# Altium schematic sheet Sheet1.SchDoc
size A3
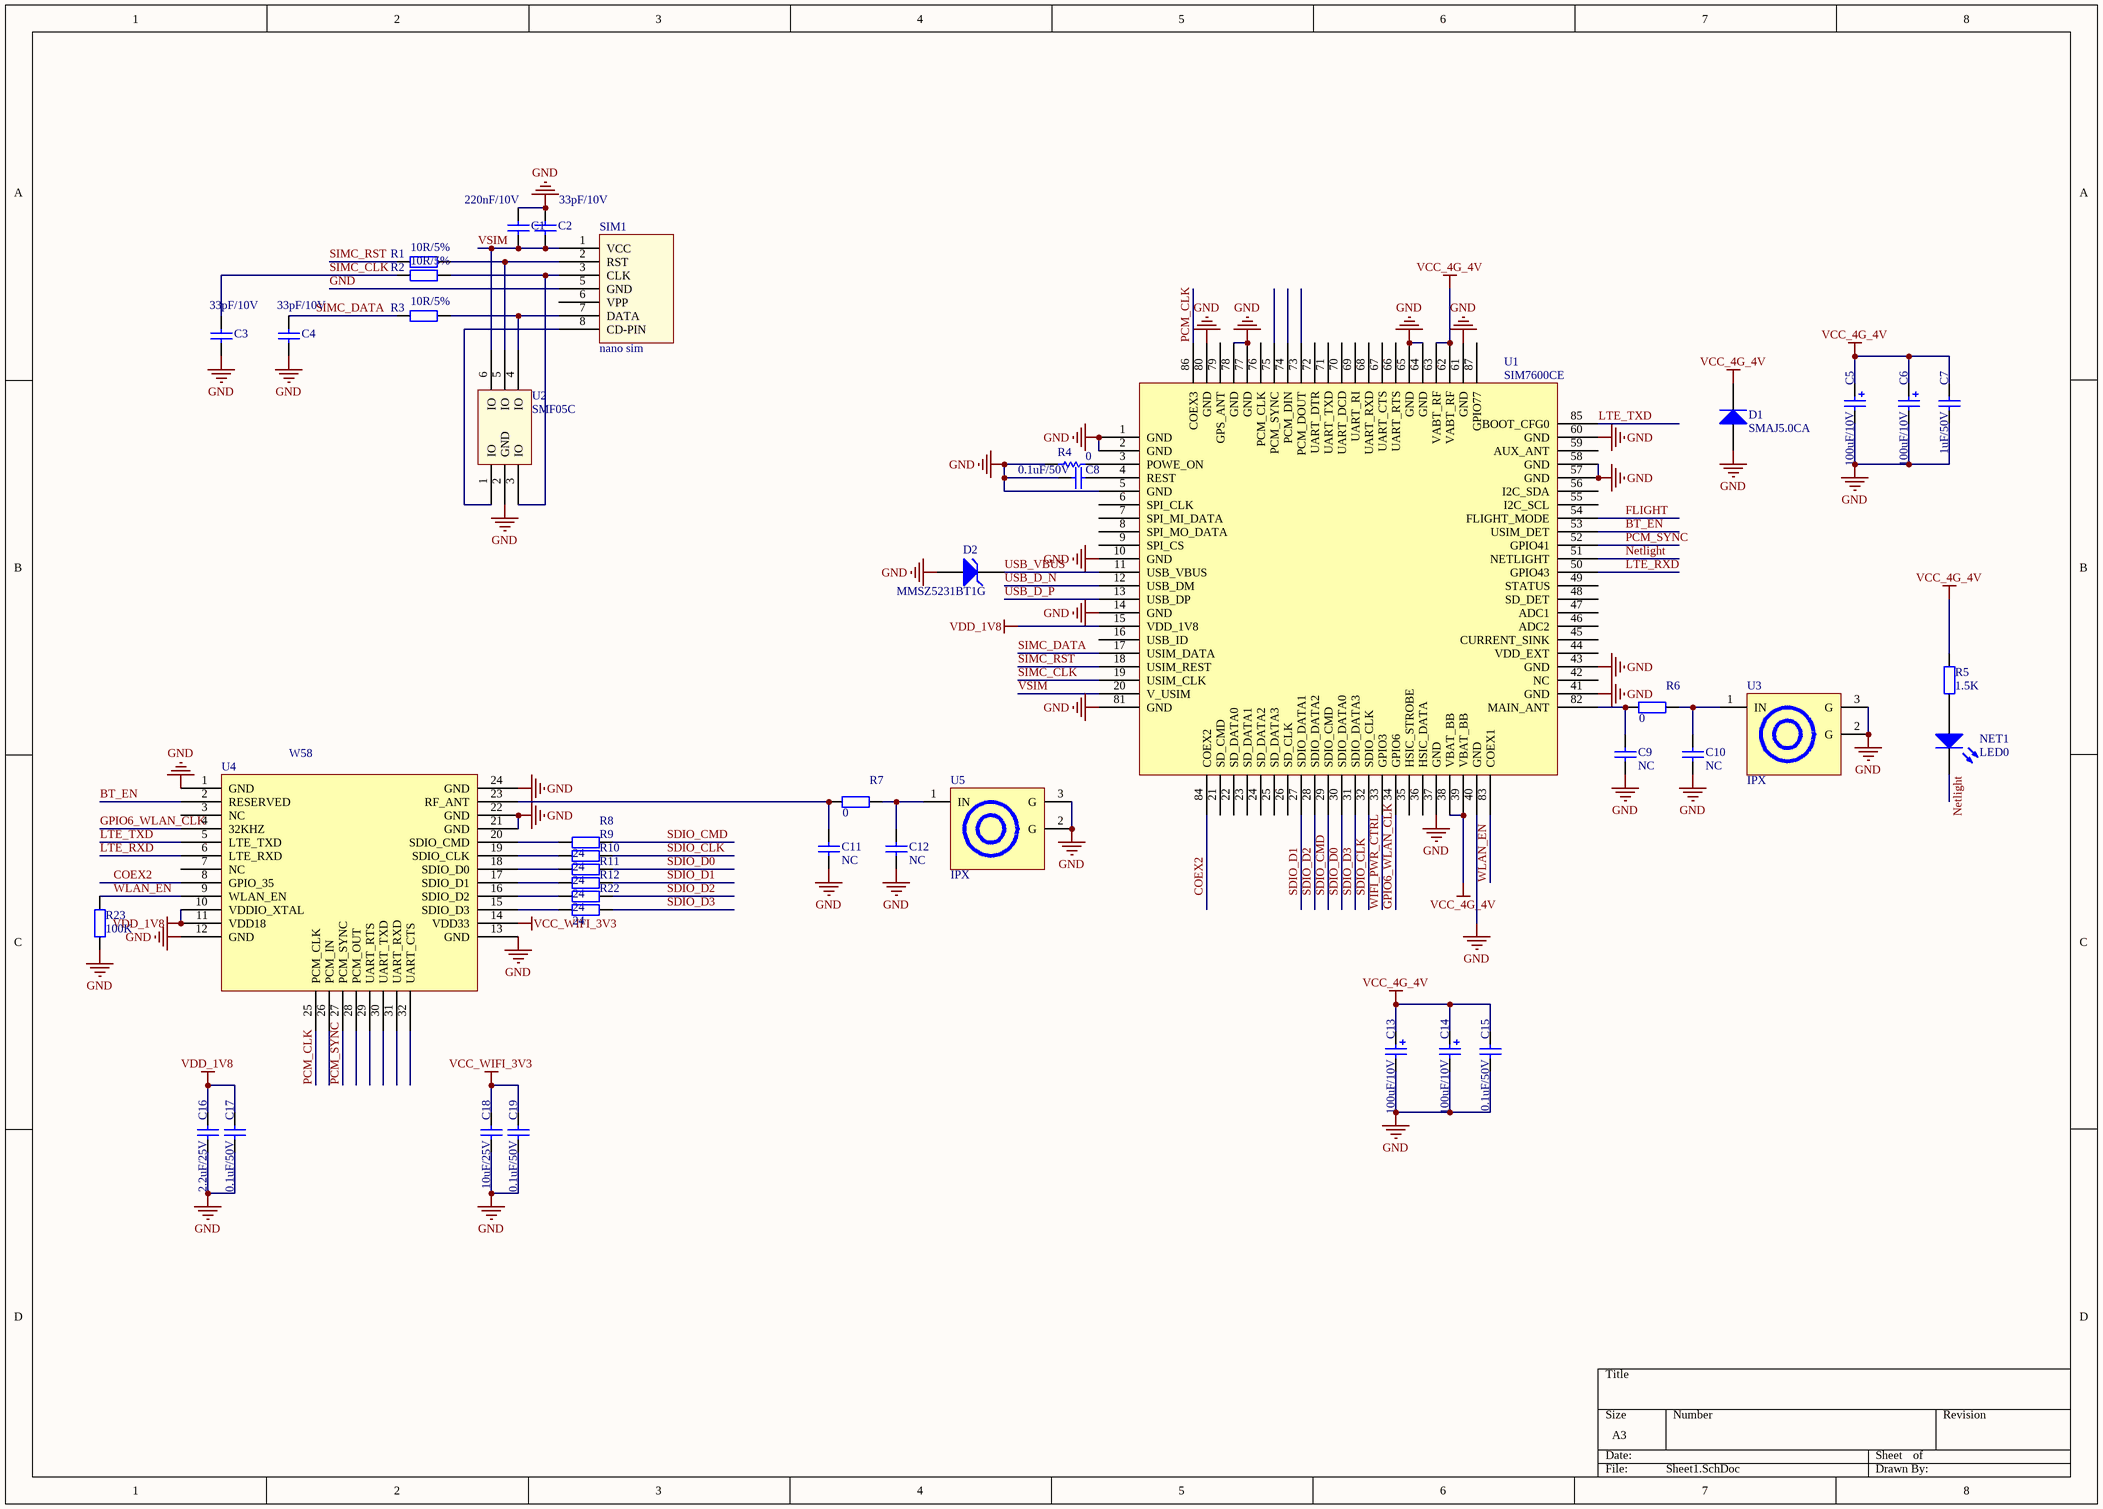
[diagram p0: Sheet1.SchDoc]

## Parts
C1  220nF/10V  [C0402]
C2  33pF/10V  [C0402]
C3  33pF/10V  [C0402]
C4  33pF/10V  [C0402]
C5  100uF/10V  [3528]
C6  100uF/10V  [3528]
C7  1uF/50V  [0402C]
C8  0.1uF/50V  [0402C]
C9  NC  [0402C]
C10  NC  [0402C]
C11  NC  [0402C]
C12  NC  [0402C]
C13  100uF/10V  [3528]
C14  100uF/10V  [3528]
C15  0.1uF/50V  [0402C]
C16  2.2uF/25V  [0402C]
C17  0.1uF/50V  [0402C]
C18  10uF/25V  [0402C]
C19  0.1uF/50V  [0402C]
D1  SMAJ5.0CA  [SMA]
D2  MMSZ5231BT1G  [SOD123]
NET1  LED0  [0603LED]
R1  10R/5%  [0402R]
R2  10R/5%  [0402R]
R3  10R/5%  [0402R]
R4  0  [0603R]
R5  1.5K  [0402R]
R6  0  [0402R]
R7  0  [0402R]
R8  24  [0402R]
R9  24  [0402R]
R10  24  [0402R]
R11  24  [0402R]
R12  24  [0402R]
R22  24  [0402R]
R23  100K  [0402R]
SIM1  nano sim  [Nano SIM]
U1  SIM7600CE  [SIM7600CE]
U2  SMF05C  [SC70-6L]
U3  IPX  [ECT8180001581]
U4  W58  [W58]
U5  IPX  [ECT8180001581]

## Nets
GND: C1.1 C2.1 C3.2 C4.2 C5.2 C6.2 C7.2 C8.1 C9.1 C10.1 C11.1 C12.1 C13.2 C14.2 C15.2 C16.2 C17.2 C18.2 C19.2 D1.1(A) D2.A R4.1 R23.1 SIM1.5(GND) U1.1(GND) U1.2(GND) U1.5(GND) U1.10(GND) U1.14(GND) U1.37(GND) U1.40(GND) U1.41(GND) U1.43(GND) U1.57(GND) U1.58(GND) U1.60(GND) U1.61(GND) U1.64(GND) U1.65(GND) U1.77(GND) U1.78(GND) U1.80(GND) U1.81(GND) U2.2(GND) U3.2(G) U3.3(G) U4.1(GND) U4.12(GND) U4.13(GND) U4.21(GND) U4.22(GND) U4.24(GND) U5.2(G) U5.3(G)
VCC_4G_4V: C5.1 C6.1 C7.1 C13.1 C14.1 C15.1 D1.2(K) R5.1 U1.38(VBAT_BB) U1.39(VBAT_BB) U1.62(VABT_RF) U1.63(VABT_RF)
VCC_WIFI_3V3: C18.1 C19.1 U4.14(VDD33)
VDD_1V8: C16.1 C17.1 U1.15(VDD_1V8) U4.10(VDDIO_XTAL) U4.11(VDD18)
BT_EN: U1.53(USIM_DET) U4.2(RESERVED)
COEX2: U1.84(COEX2) U4.8(GPIO_35)
FLIGHT: U1.54(FLIGHT_MODE)
GPIO6_WLAN_CLK: U1.34(GPIO6) U4.4(32KHZ)
LTE_RXD: U1.50(GPIO43) U4.6(LTE_RXD)
LTE_TXD: U1.85(BOOT_CFG0) U4.5(LTE_TXD)
Netlight: NET1.2(K) U1.51(NETLIGHT)
PCM_CLK: U1.86(COEX3) U4.25(PCM_CLK)
PCM_SYNC: U1.52(GPIO41) U4.27(PCM_SYNC)
SDIO_CLK: R9.2 U1.32(SDIO_CLK)
SDIO_CMD: R8.2 U1.29(SDIO_CMD)
SDIO_D0: R10.2 U1.30(SDIO_DATA0)
SDIO_D1: R11.2 U1.27(SDIO_DATA1)
SDIO_D2: R12.2 U1.28(SDIO_DATA2)
SDIO_D3: R22.2 U1.31(SDIO_DATA3)
SIMC_CLK: C3.1 R2.2 U1.19(USIM_CLK)
SIMC_DATA: C4.1 R3.2 U1.17(USIM_DATA)
SIMC_RST: R1.2 U1.18(USIM_REST)
USB_D_N: U1.12(USB_DM)
USB_D_P: U1.13(USB_DP)
USB_VBUS: D2.K U1.11(USB_VBUS)
VSIM: C1.2 C2.2 SIM1.1(VCC) U1.20(V_USIM) U2.6(IO)
WIFI_PWR_CTRL: U1.33(GPIO3)
WLAN_EN: R23.2 U1.83(COEX1) U4.9(WLAN_EN)
NetC8_2: C8.2 U1.4(REST)
NetC9_2: C9.2 R6.1 U1.82(MAIN_ANT)
NetC10_2: C10.2 R6.2 U3.1(IN)
NetC11_2: C11.2 R7.1 U4.23(RF_ANT)
NetC12_2: C12.2 R7.2 U5.1(IN)
NetNET1_1: NET1.1(A) R5.2
NetR1_1: R1.1 SIM1.2(RST) U2.5(IO)
NetR2_1: R2.1 SIM1.3(CLK) U2.3(IO)
NetR3_1: R3.1 SIM1.7(DATA) U2.4(IO)
NetR4_2: R4.2 U1.3(POWE_ON)
NetR8_1: R8.1 U4.20(SDIO_CMD)
NetR9_1: R9.1 U4.19(SDIO_CLK)
NetR10_1: R10.1 U4.18(SDIO_D0)
NetR11_1: R11.1 U4.17(SDIO_D1)
NetR12_1: R12.1 U4.16(SDIO_D2)
NetR22_1: R22.1 U4.15(SDIO_D3)
NetSIM1_8: SIM1.8(CD-PIN) U2.1(IO)

Not connected (* = marked no-connect by the designer): SIM1 6(VPP); U1 6(SPI_CLK) 7(SPI_MI_DATA) 8(SPI_MO_DATA) 9(SPI_CS) 16(USB_ID) 21(SD_CMD) 22(SD_DATA0) 23(SD_DATA1) 24(SD_DATA2) 25(SD_DATA3) 26(SD_CLK) 35(HSIC_STROBE) 36(HSIC_DATA) 42(NC) 44(VDD_EXT) 45(CURRENT_SINK) 46(ADC2) 47(ADC1) 48(SD_DET) 49(STATUS) 55(I2C_SCL) 56(I2C_SDA) 59(AUX_ANT) 66(UART_RTS) 67(UART_CTS) 68(UART_RXD) 69(UART_RI) 70(UART_DCD) 71(UART_TXD) 72(UART_DTR) 73(PCM_DOUT) 74(PCM_DIN) 75(PCM_SYNC) 76(PCM_CLK) 79(GPS_ANT) 87(GPIO77); U4 3(NC) 7(NC) 26(PCM_IN) 28(PCM_OUT) 29(UART_RTS) 30(UART_TXD) 31(UART_RXD) 32(UART_CTS)

## Library data of the parts
C1-C4 C7-C12 C15-C19 = Cap: Capacitor; Value: 0.1uF/10V; Published: 8-Jun-2000; LatestRevisionDate: 17-Jul-2002; LatestRevisionNote: Re-released for DXP Platform.; PackageReference: RAD-0.3; Publisher: Altium Limited
C5 C6 C13 C14 = Cap Pol2: Polarized Capacitor (Axial); Value: 220uF/10V; Published: 8-Jun-2000; LatestRevisionDate: 17-Jul-2002; LatestRevisionNote: Re-released for DXP Platform.; PackageReference: POLAR0.8; Publisher: Altium Limited
D1 = Diode: Default Diode; Published: 8-Jun-2000; LatestRevisionDate: 17-Jul-2002; LatestRevisionNote: Re-released for DXP Platform.; PackageVersion: Sep-1996; PackageReference: SMC; Publisher: Altium Limited; Code_JEDEC: DO-214-AB
D2 = D Zener: Zener Diode; Published: 8-Jun-2000; LatestRevisionDate: 17-Jul-2002; LatestRevisionNote: Re-released for DXP Platform.; PackageReference: DIODE-0.7; Publisher: Altium Limited
NET1 = LED0: Typical INFRARED GaAs LED; Published: 8-Jun-2000; LatestRevisionDate: 08-Jul-2005; LatestRevisionNote: Mech Layer 1 removed.; PackageReference: LED-0; Publisher: Altium Limited
R1-R3 = Res2: Resistor; Value: 10R; Published: 8-Jun-2000; LatestRevisionDate: 17-Jul-2002; LatestRevisionNote: Re-released for DXP Platform.; PackageReference: AXIAL-0.4; Publisher: Altium Limited
R4 = Res1: Resistor; Value: 100K; Published: 8-Jun-2000; LatestRevisionDate: 17-Jul-2002; LatestRevisionNote: Re-released for DXP Platform.; PackageReference: AXIAL-0.3; Publisher: Altium Limited
R5-R12 R22 R23 = Res2: Resistor; Value: 1K; Published: 8-Jun-2000; LatestRevisionDate: 17-Jul-2002; LatestRevisionNote: Re-released for DXP Platform.; PackageReference: AXIAL-0.4; Publisher: Altium Limited
U3 U5 = IPX: MCU; ComponentLink1Description: 供应商链接; ComponentLink1URL: http://www.szlcsc.com/product/details_9202.html; Package: LQFP-44_10x10x08P; Supplier: LC; SuppliersPartNumber: C8696